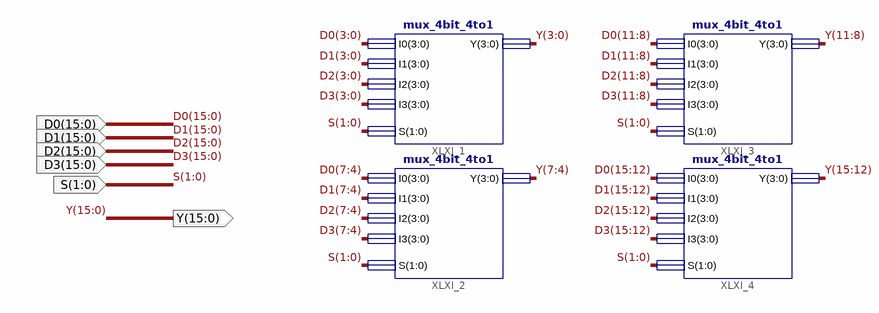
[diagram p0: schematic sheet 1]
// Xilinx ISE schematic mux_16bit_4to1.sch (virtex6) as structural Verilog: 4 symbols, 6 ports
module mux_16bit_4to1 (
  input  [1:0] S,
  input  [15:0] D0,
  input  [15:0] D1,
  input  [15:0] D2,
  input  [15:0] D3,
  output [15:0] Y
);

  mux_4bit_4to1 XLXI_1 (.S(S), .I3(D3[3:0]), .I2(D2[3:0]), .I1(D1[3:0]), .I0(D0[3:0]), .Y(Y[3:0]));
  mux_4bit_4to1 XLXI_2 (.S(S), .I3(D3[7:4]), .I2(D2[7:4]), .I1(D1[7:4]), .I0(D0[7:4]), .Y(Y[7:4]));
  mux_4bit_4to1 XLXI_3 (.S(S), .I3(D3[11:8]), .I2(D2[11:8]), .I1(D1[11:8]), .I0(D0[11:8]), .Y(Y[11:8]));
  mux_4bit_4to1 XLXI_4 (.S(S), .I3(D3[15:12]), .I2(D2[15:12]), .I1(D1[15:12]), .I0(D0[15:12]), .Y(Y[15:12]));
endmodule
